# Altium schematic sheet P16-Connector.SchDoc
size A4
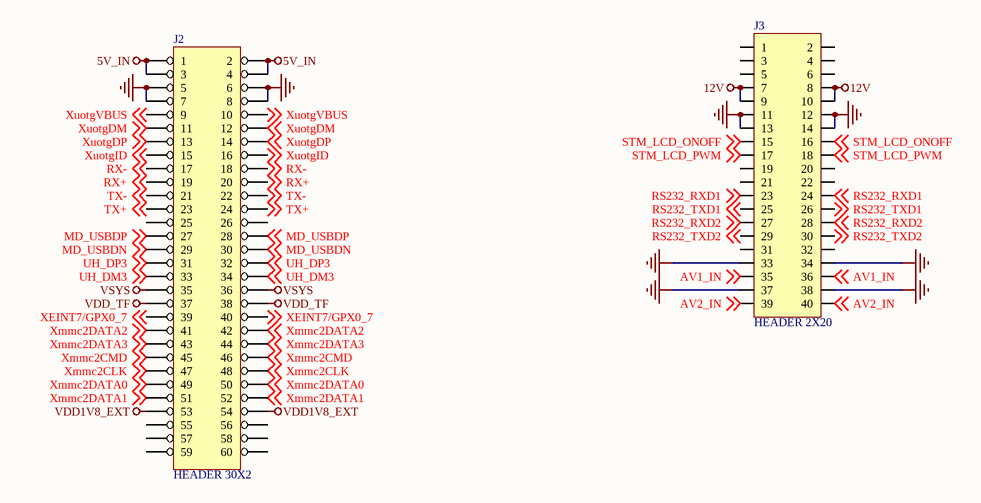
[diagram p0: P16-Connector.SchDoc]

## Parts
J2  HEADER 30X2  [HD2X30-2.00]
J3  HEADER 2X20  [HD2X20-2.00]

## Nets
5V_IN: J2.1 J2.2 J2.3 J2.4
12V: J3.7 J3.8 J3.9 J3.10
GND: J2.5 J2.6 J2.7 J2.8 J3.11 J3.12 J3.13 J3.14 J3.33 J3.34 J3.37 J3.38
VDD1V8_EXT: J2.53 J2.54
VDD_TF: J2.37 J2.38
VSYS: J2.35 J2.36
AV1_IN: J3.35 J3.36 ; off-sheet AV1_IN
AV2_IN: J3.39 J3.40 ; off-sheet AV2_IN
MD_USBDN: J2.29 J2.30 ; off-sheet MD_USBDN
MD_USBDP: J2.27 J2.28 ; off-sheet MD_USBDP
RS232_RXD1: J3.23 J3.24 ; off-sheet RS232_RXD1
RS232_RXD2: J3.27 J3.28 ; off-sheet RS232_RXD2
RS232_TXD1: J3.25 J3.26 ; off-sheet RS232_TXD1
RS232_TXD2: J3.29 J3.30 ; off-sheet RS232_TXD2
RX+: J2.19 J2.20 ; off-sheet RX+
RX-: J2.17 J2.18 ; off-sheet RX-
STM_LCD_ONOFF: J3.15 J3.16 ; off-sheet STM_LCD_ONOFF
STM_LCD_PWM: J3.17 J3.18 ; off-sheet STM_LCD_PWM
TX+: J2.23 J2.24 ; off-sheet TX+
TX-: J2.21 J2.22 ; off-sheet TX-
UH_DM3: J2.33 J2.34 ; off-sheet UH_DM3
UH_DP3: J2.31 J2.32 ; off-sheet UH_DP3
XEINT7/GPX0_7: J2.39 J2.40 ; off-sheet XEINT7/GPX0_7
Xmmc2CLK: J2.47 J2.48 ; off-sheet Xmmc2CLK
Xmmc2CMD: J2.45 J2.46 ; off-sheet Xmmc2CMD
Xmmc2DATA0: J2.49 J2.50 ; off-sheet Xmmc2DATA0
Xmmc2DATA1: J2.51 J2.52 ; off-sheet Xmmc2DATA1
Xmmc2DATA2: J2.41 J2.42 ; off-sheet Xmmc2DATA2
Xmmc2DATA3: J2.43 J2.44 ; off-sheet Xmmc2DATA3
XuotgDM: J2.11 J2.12 ; off-sheet XuotgDM
XuotgDP: J2.13 J2.14 ; off-sheet XuotgDP
XuotgID: J2.15 J2.16 ; off-sheet XuotgID
XuotgVBUS: J2.9 J2.10 ; off-sheet XuotgVBUS

Not connected (* = marked no-connect by the designer): J2 25 26 55 56 57 58 59 60; J3 1 2 3 4 5 6 19 20 21 22 31 32